# Altium schematic sheet [2]_Inverter.SchDoc
size A4; Author: Tomislav Ivaniš; DrawnBy: Tomislav Ivaniš; Revision: 1; ProjectName: MicroInverterMKI
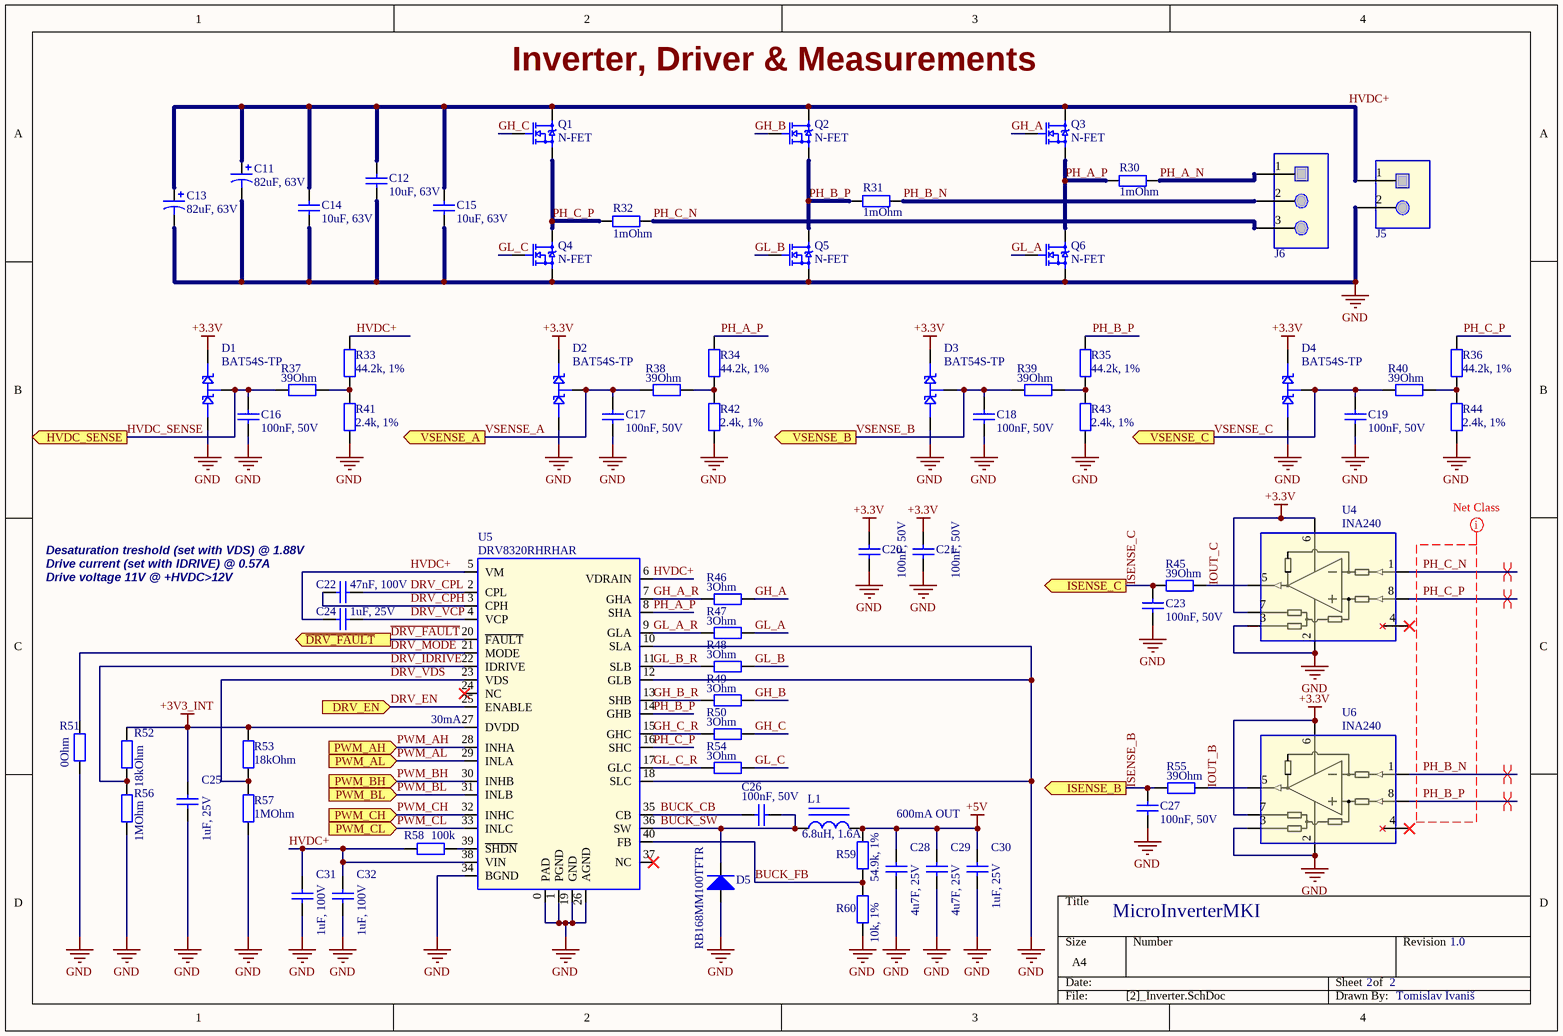
[diagram p0: [2]_Inverter.SchDoc]

## Parts
C11  82uF, 63V  [CAP_H10]
C12  10uF, 63V  [1210]
C13  82uF, 63V  [CAP_H10]
C14  10uF, 63V  [1210]
C15  10uF, 63V  [1210]
C16  100nF, 50V  [0603]
C17  100nF, 50V  [0603]
C18  100nF, 50V  [0603]
C19  100nF, 50V  [0603]
C20  100nF, 50V  [0603]
C21  100nF, 50V  [0603]
C22  47nF, 100V  [0805]
C23  100nF, 50V  [0603]
C24  1uF, 25V  [0805]
C25  1uF, 25V  [0805]
C26  100nF, 50V  [0603]
C27  100nF, 50V  [0603]
C28  4u7F, 25V  [0805]
C29  4u7F, 25V  [0805]
C30  1uF, 25V  [0805]
C31  1uF, 100V  [0805]
C32  1uF, 100V  [0805]
D1  BAT54S-TP  [SOT 23]
D2  BAT54S-TP  [SOT 23]
D3  BAT54S-TP  [SOT 23]
D4  BAT54S-TP  [SOT 23]
D5  RB168MM100TFTR  [SOD123]
J5  TERMINAL 2  [TERMINAL 2 POS]  (value not drawn)
J6  TERMINAL 3  [TERMINAL 3 POS]  (value not drawn)
L1  6.8uH, 1.6A  [INDUCTOR - 4x4 mm]
Q1  N-FET  [SO-8FL]
Q2  N-FET  [SO-8FL]
Q3  N-FET  [SO-8FL]
Q4  N-FET  [SO-8FL]
Q5  N-FET  [SO-8FL]
Q6  N-FET  [SO-8FL]
R30  1mOhm  [RES TLR2HW CURRENT SENSE]
R31  1mOhm  [RES TLR2HW CURRENT SENSE]
R32  1mOhm  [RES TLR2HW CURRENT SENSE]
R33  44.2k, 1%  [0805]
R34  44.2k, 1%  [0805]
R35  44.2k, 1%  [0805]
R36  44.2k, 1%  [0805]
R37  39Ohm  [0805]
R38  39Ohm  [0805]
R39  39Ohm  [0805]
R40  39Ohm  [0805]
R41  2.4k, 1%  [0805]
R42  2.4k, 1%  [0805]
R43  2.4k, 1%  [0805]
R44  2.4k, 1%  [0805]
R45  39Ohm  [0805]
R46  3Ohm  [0805]
R47  3Ohm  [0805]
R48  3Ohm  [0805]
R49  3Ohm  [0805]
R50  3Ohm  [0805]
R51  0Ohm  [0805]
R52  18kOhm  [0805]
R53  18kOhm  [0805]
R54  3Ohm  [0805]
R55  39Ohm  [0805]
R56  1MOhm  [0805]
R57  1MOhm  [0805]
R58  100k  [0805]
R59  54.9k, 1%  [0805]
R60  10k, 1%  [0805]
U4  INA240  [SO 8 - HighDensity]
U5  DRV8320RHRHAR  [VQFN-40]
U6  INA240  [SO 8 - HighDensity]

## Ports
DRV_EN (in), HVDC_SENSE (out), ISENSE_B (out), ISENSE_C (out), PWM_AH (in), PWM_AL (in), PWM_BH (in), PWM_BL (in), PWM_CH (in), PWM_CL (in), VSENSE_A (out), VSENSE_B (out), VSENSE_C (out), ~{DRV_FAULT} (out)

## Nets
+3.3V: C20.1 C21.1 D1.3(K) D2.3(K) D3.3(K) D4.3(K) U4.6 U4.7 U6.6 U6.7
+3V3_INT: C25.1 R52.2 R53.2 U5.27(DVDD)
+5V: C28.1 C29.1 C30.1 L1.2 R59.2
GND: C11.1 C12.2 C13.1 C14.2 C15.2 C16.2 C17.2 C18.2 C19.2 C20.2 C21.2 C23.2 C25.2 C27.2 C28.2 C29.2 C30.2 C31.2 C32.2 D1.2(A) D2.2(A) D3.2(A) D4.2(A) D5.1(A) J5.2 Q4.3 Q5.3 Q6.3 R41.1 R42.1 R43.1 R44.1 R51.1 R56.1 R57.1 R60.1 U4.2 U4.3 U5.0(PAD) U5.1(PGND) U5.10(SLA) U5.12(GLB) U5.18(SLC) U5.19(GND) U5.26(AGND) U5.34(BGND) U6.2 U6.3
BUCK_CB: C26.2 U5.35(CB)
BUCK_FB: R59.1 R60.2 U5.40(FB)
BUCK_SW: C26.1 D5.2(K) L1.1 U5.36(SW)
~{DRV_FAULT}: U5.20(~{FAULT}) ; port ~{DRV_FAULT}
DRV_CPH: C22.1 U5.3(CPH)
DRV_CPL: C22.2 U5.2(CPL)
DRV_EN: U5.25(ENABLE) ; port DRV_EN
DRV_IDRIVE: R52.1 R56.2 U5.22(IDRIVE)
DRV_MODE: R51.2 U5.21(MODE)
DRV_VCP: C24.1 U5.4(VCP)
DRV_VDS: R53.1 R57.2 U5.23(VDS)
GH_A: Q3.1 R46.2
GH_A_R: R46.1 U5.7(GHA)
GH_B: Q2.1 R49.2
GH_B_R: R49.1 U5.13(SHB)
GH_C: Q1.1 R50.2
GH_C_R: R50.1 U5.15(GHC)
GL_A: Q6.1 R47.2
GL_A_R: R47.1 U5.9(GLA)
GL_B: Q5.1 R48.2
GL_B_R: R48.1 U5.11(SLB)
GL_C: Q4.1 R54.2
GL_C_R: R54.1 U5.17(GLC)
HVDC+: C11.2 C12.1 C13.2 C14.1 C15.1 C24.2 C31.1 C32.1 J5.1 Q1.2 Q2.2 Q3.2 R33.2 R58.2 U5.5(VM) U5.6(VDRAIN) U5.38(VIN)
HVDC_SENSE: C16.1 D1.1(KA) R37.1 ; port HVDC_SENSE
IOUT_B: R55.2 U6.5(OUT)
IOUT_C: R45.2 U4.5(OUT)
ISENSE_B: C27.1 R55.1 ; port ISENSE_B
ISENSE_C: C23.1 R45.1 ; port ISENSE_C
PH_A_N: J6.1 R30.2
PH_A_P: Q3.3 Q6.2 R30.1 R34.2 U5.8(SHA)
PH_B_N: J6.2 R31.2 U6.1(IN-)
PH_B_P: Q2.3 Q5.2 R31.1 R35.2 U5.14(GHB) U6.8(IN+)
PH_C_N: J6.3 R32.2 U4.1(IN-)
PH_C_P: Q1.3 Q4.2 R32.1 R36.2 U4.8(IN+) U5.16(SHC)
PWM_AH: U5.28(INHA) ; port PWM_AH
PWM_AL: U5.29(INLA) ; port PWM_AL
PWM_BH: U5.30(INHB) ; port PWM_BH
PWM_BL: U5.31(INLB) ; port PWM_BL
PWM_CH: U5.32(INHC) ; port PWM_CH
PWM_CL: U5.33(INLC) ; port PWM_CL
VSENSE_A: C17.1 D2.1(KA) R38.1 ; port VSENSE_A
VSENSE_B: C18.1 D3.1(KA) R39.1 ; port VSENSE_B
VSENSE_C: C19.1 D4.1(KA) R40.1 ; port VSENSE_C
NetR33_1: R33.1 R37.2 R41.2
NetR34_1: R34.1 R38.2 R42.2
NetR35_1: R35.1 R39.2 R43.2
NetR36_1: R36.1 R40.2 R44.2
NetR58_1: R58.1 U5.39(~{SHDN})

Not connected (* = marked no-connect by the designer): U4 4(NC)*; U5 24(NC)* 37(NC)*; U6 4(NC)*

## Layout directives
differential pair; net class DIFF75: PH_B_N, PH_B_P, PH_C_N, PH_C_P
net class DIFF_RSENSE: PH_B_N, PH_B_P, PH_C_N, PH_C_P

## Notes on the sheet
- Inverter, Driver & Measurements
- Desaturation treshold (set with VDS) @ 1.88V
- Drive current (set with IDRIVE) @ 0.57A
- Drive voltage 11V @ +HVDC>12V
- (near U5) 30mA
- 600mA OUT
- MicroInverterMKI
- 2
- 1.0

## Library data of the parts
C11 C13 = Cap Pol: Capacitor Polarized; Manufacturer Part Number: HHXC630ARA820MJA0G
C12 C14 C15 = Cap Semi: Capacitor; Manufacturer Part Number: GRM32ER71J106KA12L
C16-C21 C23 C26 C27 = Cap Semi: Capacitor; Manufacturer Part Number: C0603C104M5RACTU
C22 = Cap Semi: Capacitor; Manufacturer Part Number: CC0805KKX7R0BB473
C24 C25 C30 = Cap Semi: Capacitor; Manufacturer Part Number: VJ0805Y105KXXTW1BC
C28 C29 = Cap Semi: Capacitor; Manufacturer Part Number: 885012107018
C31 C32 = Cap Semi: Capacitor; Manufacturer Part Number: HMK212BBJ105KG-TE
D5 = Diode: Manufacturer Part Number: RB168MM100TFTR
J5 = TERMINAL 2: TERMINAL BLOCK 2 POS; Manufacturer part number: *
J6 = TERMINAL 3: TERMINAL BLOCK 3 POS; Manufacturer part number: *
L1 = Inductor Iron: Magnetic-Core Inductor; Manufacturer Part Number: TYS40306R8M-10
Q1-Q6 = N-FET: Manufacturer Part Number: NVMFS6H800NT1G
R30-R32 = Res: Resistor; Manufacturer Part Number: TLR2HWDTE1L00F50
R33-R36 = Res: Resistor; Manufacturer Part Number: CR0805-FX-4422ELF
R37-R40 R45 R55 = Res: Resistor; Manufacturer Part Number: CR0805-JW-390ELF
R41-R44 = Res: Resistor; Manufacturer Part Number: CR0805-FX-2401ELF
R46-R50 R54 = Res: Resistor; Manufacturer Part Number: SG73P2ATTD3R00F
R51 = Res: Resistor; Manufacturer Part Number: CR0805-J/-000ELF
R52 R53 = Res: Resistor; Manufacturer Part Number: CR0805-FX-1802ELF
R56 R57 = Res: Resistor; Manufacturer Part Number: CR0805-FW-1005ELF
R58 = Res: Resistor; Manufacturer Part Number: CR0805-FX-1003ELF
R59 = Res: Resistor; Manufacturer Part Number: CR0805-FX-5492ELF
R60 = Res: Resistor; Manufacturer Part Number: CR0805-FX-1002ELF
U4 U6 = INA240: Manufacturer part number: INA240A2DR
U5 = DRV8320RHRHAR: 3f Gate driver 60V; Manufacturer part number: DRV8320RHRHAR
D1-D4 = BAT54S-TP: Manufacturer part number: BAT54S-TP